# Altium schematic sheet mcu_blk.SchDoc
size A4; Engineer: JBayalas; DocumentNumber: 8; Revision: V2.0; SheetNumber: 8; SheetTotal: 10
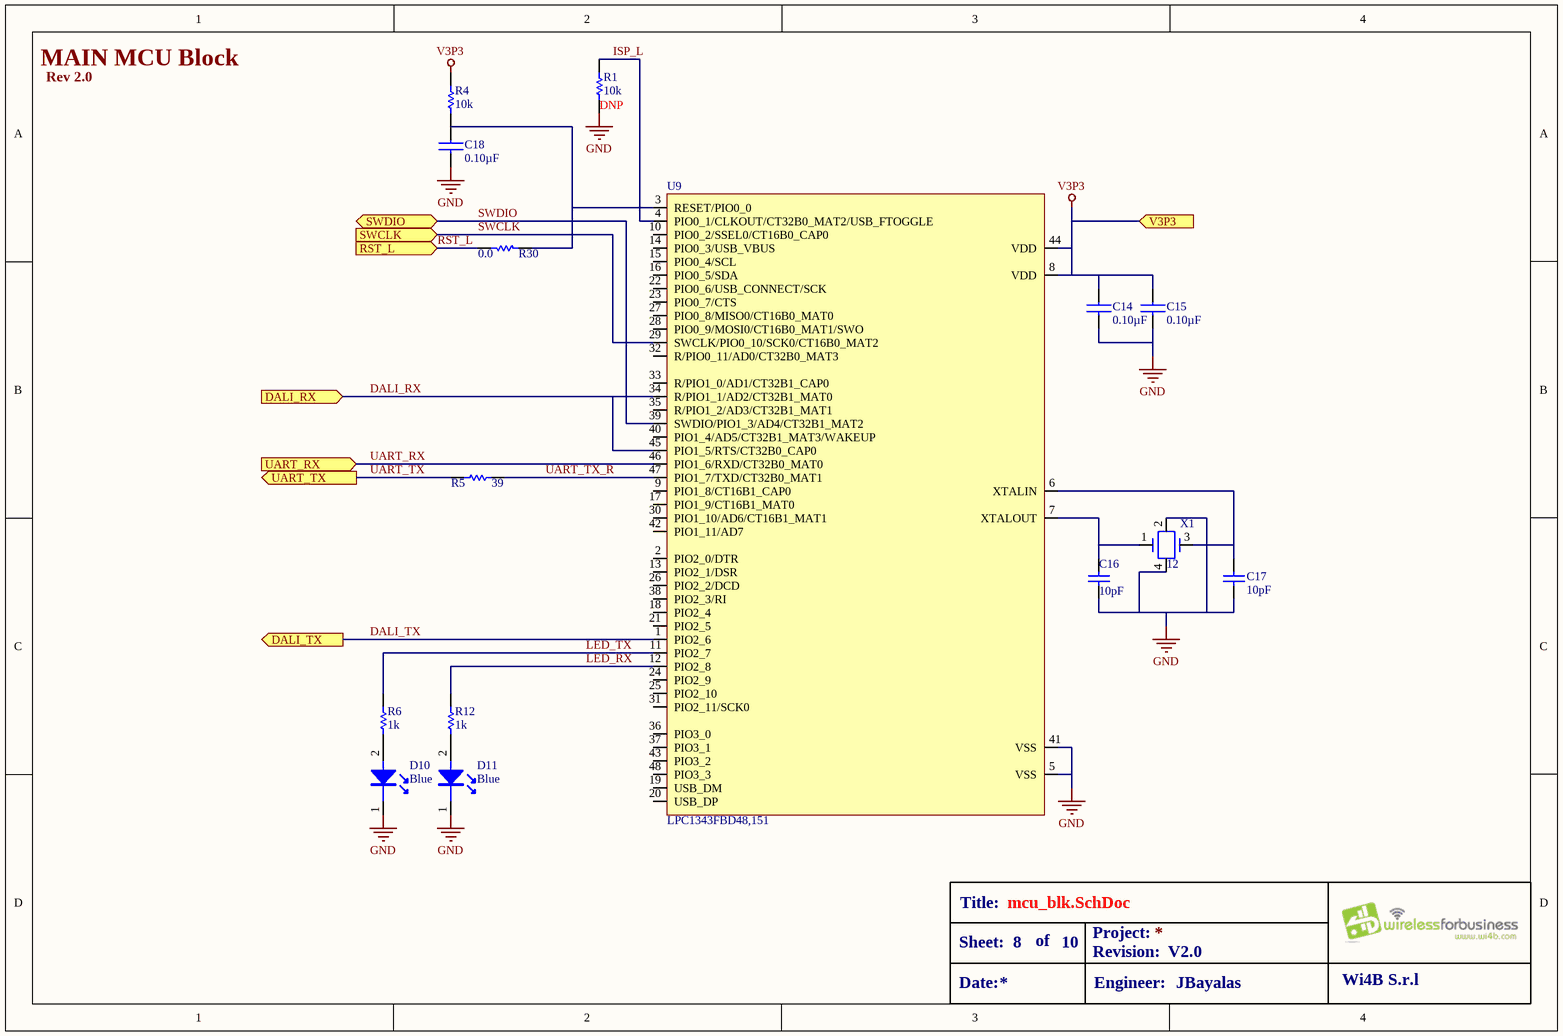
[diagram p0: mcu_blk.SchDoc]

## Parts
C14  value 0.10µF  [C0402]  (hidden comment: GRM155R71H104ME14D)
C15  value 0.10µF  [C0402]  (hidden comment: GRM155R71H104ME14D)
C16  value 10pF  [C0402]  (hidden comment: GRM1555C1H100FA01D)
C17  value 10pF  [C0402]  (hidden comment: GRM1555C1H100FA01D)
C18  value 0.10µF  [C0402]  (hidden comment: GRM155R71H104ME14D)
D10  value Blue  [LED0402(BLUE)]  (hidden comment: VLMB1500-GS08)
D11  value Blue  [LED0402(BLUE)]  (hidden comment: VLMB1500-GS08)
R1  value 10k  [R0402]  (hidden comment: MCS04020C1002FE000)
R4  value 10k  [R0402]  (hidden comment: ERJ-2RKF1002X)
R5  value 39  [R0402]  (hidden comment: CRCW040239R0FKED)
R6  value 1k  [R0402]  (hidden comment: ERJ-2RKF1001X)
R12  value 1k  [R0402]  (hidden comment: ERJ-2RKF1001X)
R30  value 0.0  [R0402]  (hidden comment: *)
U9  (no value)  [LQFP-48(7x7mm body)]
X1  Frequency Nom: 12  [4SMD-crystal]  (hidden comment: ABM8G-12.000MHZ-18-D2Y-T)

## Ports
DALI_RX (in), DALI_TX (out), RST_L (in), SWCLK (in), SWDIO (bidir), UART_RX (in), UART_TX (out), V3P3 (in)

## Nets
GND: C14.2 C15.2 C16.1 C17.1 C18.2 D10.1 D11.1 R1.1 U9.5(VSS) U9.41(VSS) X1.2 X1.4
V3P3: C14.1 C15.1 R4.2 U9.8(VDD) U9.44(VDD) ; port V3P3
DALI_RX: U9.34(R/PIO1_1/AD2/CT32B1_MAT0) U9.45(PIO1_5/RTS/CT32B0_CAP0) ; port DALI_RX
DALI_TX: U9.1(PIO2_6) ; port DALI_TX
ISP_L: R1.2 U9.4(PIO0_1/CLKOUT/CT32B0_MAT2/USB_FTOGGLE)
LED_RX: R12.2 U9.12(PIO2_8)
LED_TX: R6.2 U9.11(PIO2_7)
RST_L: R30.1 ; port RST_L
SWCLK: U9.29(SWCLK/PIO0_10/SCK0/CT16B0_MAT2) ; port SWCLK
SWDIO: U9.39(SWDIO/PIO1_3/AD4/CT32B1_MAT2) ; port SWDIO
UART_RX: U9.46(PIO1_6/RXD/CT32B0_MAT0) ; port UART_RX
UART_TX: R5.1 ; port UART_TX
UART_TX_R: R5.2 U9.47(PIO1_7/TXD/CT32B0_MAT1)
NetC16_2: C16.2 U9.7(XTALOUT) X1.1
NetC17_2: C17.2 U9.6(XTALIN) X1.3
NetC18_1: C18.1 R4.1 R30.2 U9.3(RESET/PIO0_0)
NetD10_2: D10.2 R6.1
NetD11_2: D11.2 R12.1

Not connected (* = marked no-connect by the designer): U9 2(PIO2_0/DTR) 9(PIO1_8/CT16B1_CAP0) 10(PIO0_2/SSEL0/CT16B0_CAP0) 13(PIO2_1/DSR) 14(PIO0_3/USB_VBUS) 15(PIO0_4/SCL) 16(PIO0_5/SDA) 17(PIO1_9/CT16B1_MAT0) 18(PIO2_4) 19(USB_DM) 20(USB_DP) 21(PIO2_5) 22(PIO0_6/USB_CONNECT/SCK) 23(PIO0_7/CTS) 24(PIO2_9) 25(PIO2_10) 26(PIO2_2/DCD) 27(PIO0_8/MISO0/CT16B0_MAT0) 28(PIO0_9/MOSI0/CT16B0_MAT1/SWO) 30(PIO1_10/AD6/CT16B1_MAT1) 31(PIO2_11/SCK0) 32(R/PIO0_11/AD0/CT32B0_MAT3) 33(R/PIO1_0/AD1/CT32B1_CAP0) 35(R/PIO1_2/AD3/CT32B1_MAT1) 36(PIO3_0) 37(PIO3_1) 38(PIO2_3/RI) 40(PIO1_4/AD5/CT32B1_MAT3/WAKEUP) 42(PIO1_11/AD7) 43(PIO3_2) 48(PIO3_3)

## Notes on the sheet
- Rev 2.0
- MAIN MCU Block
- Title:
- Sheet:
- Date:
- of
- Project:
- Revision:
- Engineer:
- Wi4B S.r.l

## Library data of the parts
C14 C15 C18 = GRM155R71H104ME14D: CAP CER 0.1UF 50V X7R 0402; MFT: Murata Electronics North America; TYPE: SMD; FUNCTION: DALI_MCU; MPN: GRM155R71H104ME14D; RATING: 50V; DNP: *
C16 C17 = GRM1555C1H100FA01D: CAP CER 10PF 50V 1% NP0 0402; MFT: Murata Electronics North America; TYPE: Surface Mount, MLCC; FUNCTION: DALI_MCU; MPN: GRM1555C1H100FA01D; RATING: 50V
D10 D11 = VLMB1500-GS08: LED BLUE 0402 SMD; MFT: Vishay Semiconductor Opto Division; FUNCTION: DALI_MCU; MPN: VLMB1500-GS08; TYPE: SMD; RATING: *; DNP: *
R1 = MCS04020C1002FE000: RES SMD 10K OHM 1% 1/10W 0402; MFT: Vishay Beyschlag; FUNCTION: DALI_MCU; MPN: MCS04020C1002FE000; TYPE: SMD; RATING: 1/10W; DNP: DNP
R4 = ERJ-2RKF1002X: RES SMD 10K OHM 1% 1/10W 0402; MFT: Panasonic Electronic Components; RATING: 0.1W, 1/10W; FUNCTION: DALI_MCU; MPN: ERJ-2RKF1002X; TYPE: Surface Mount
R5 = CRCW040239R0FKED: RES SMD 39 OHM 1% 1/16W 0402; MFT: Vishay Dale; FUNCTION: DALI_MCU; MPN: CRCW040239R0FKED; TYPE: SMD; RATING: 1/16W; DNP: *
R6 R12 = ERJ-2RKF1001X: RES SMD 1K OHM 1% 1/10W 0402; MFT: Panasonic Electronic Components; RATING: 0.1W, 1/10W; FUNCTION: DALI_MCU; MPN: ERJ-2RKF1001X; TYPE: Surface Mount
R30 = CRCW04020000Z0ED: RES SMD 0.0OHM JUMPER 1/16W 0402; MFT: Vishay Dale; RATING: 63mW; MPN: CRCW04020000Z0ED; TYPE: Surface Mount
U9 = LPC1343FBD48,151: IC MCU ARM 32KB FLASH 48LQFP; MFT: NXP; MPN: LPC1343FBD48,151; TYPE: SMD; VALUE: LPC1343FBD48,151
X1 = ABM8G-12.000MHZ-18-D2Y-T: ABRACON - ABM8G-12.000MHZ-18-D2Y-T - CRYSTAL, 12MHz,18pF, 3.2mm x 2.5mm SMD, FULL REEL; Frequency Stability + / -: 30; Frequency Tolerance + / -: 20; Load Capacitance: 18; FUNCTION: DALI_MCU; Supplier 1: Farnell; Manufacturer: ABRACON; Manufacturer Part Number: ABM8G-12.000MHZ-18-D2Y-T; RoHS: Y-EX; Stock 1: 3995; Pricing 1: 1000=0.86, 3000=0.832, 5000=0.802, 10000=0.774 (GBP); Product Range: ABRACON - ABM8; Crystal Case: 3.2mm x 2.5; ComponentLink1URL: http://www.abracon.com/Resonators/ABM8G.pdf; ComponentLink1Description: http://www.abracon.com/Resonators/ABM8G.pdf; Supplier Part Number 1: 2368793